# EasyEDA schematic SCH_mev battery_2023-11-28.json
TITLE: Mev latch circuit; REV: 2.0; Date: 2023-10-29; Sheet: 1/1; Drawn By: Stefano Scipioni; Company: Galileo
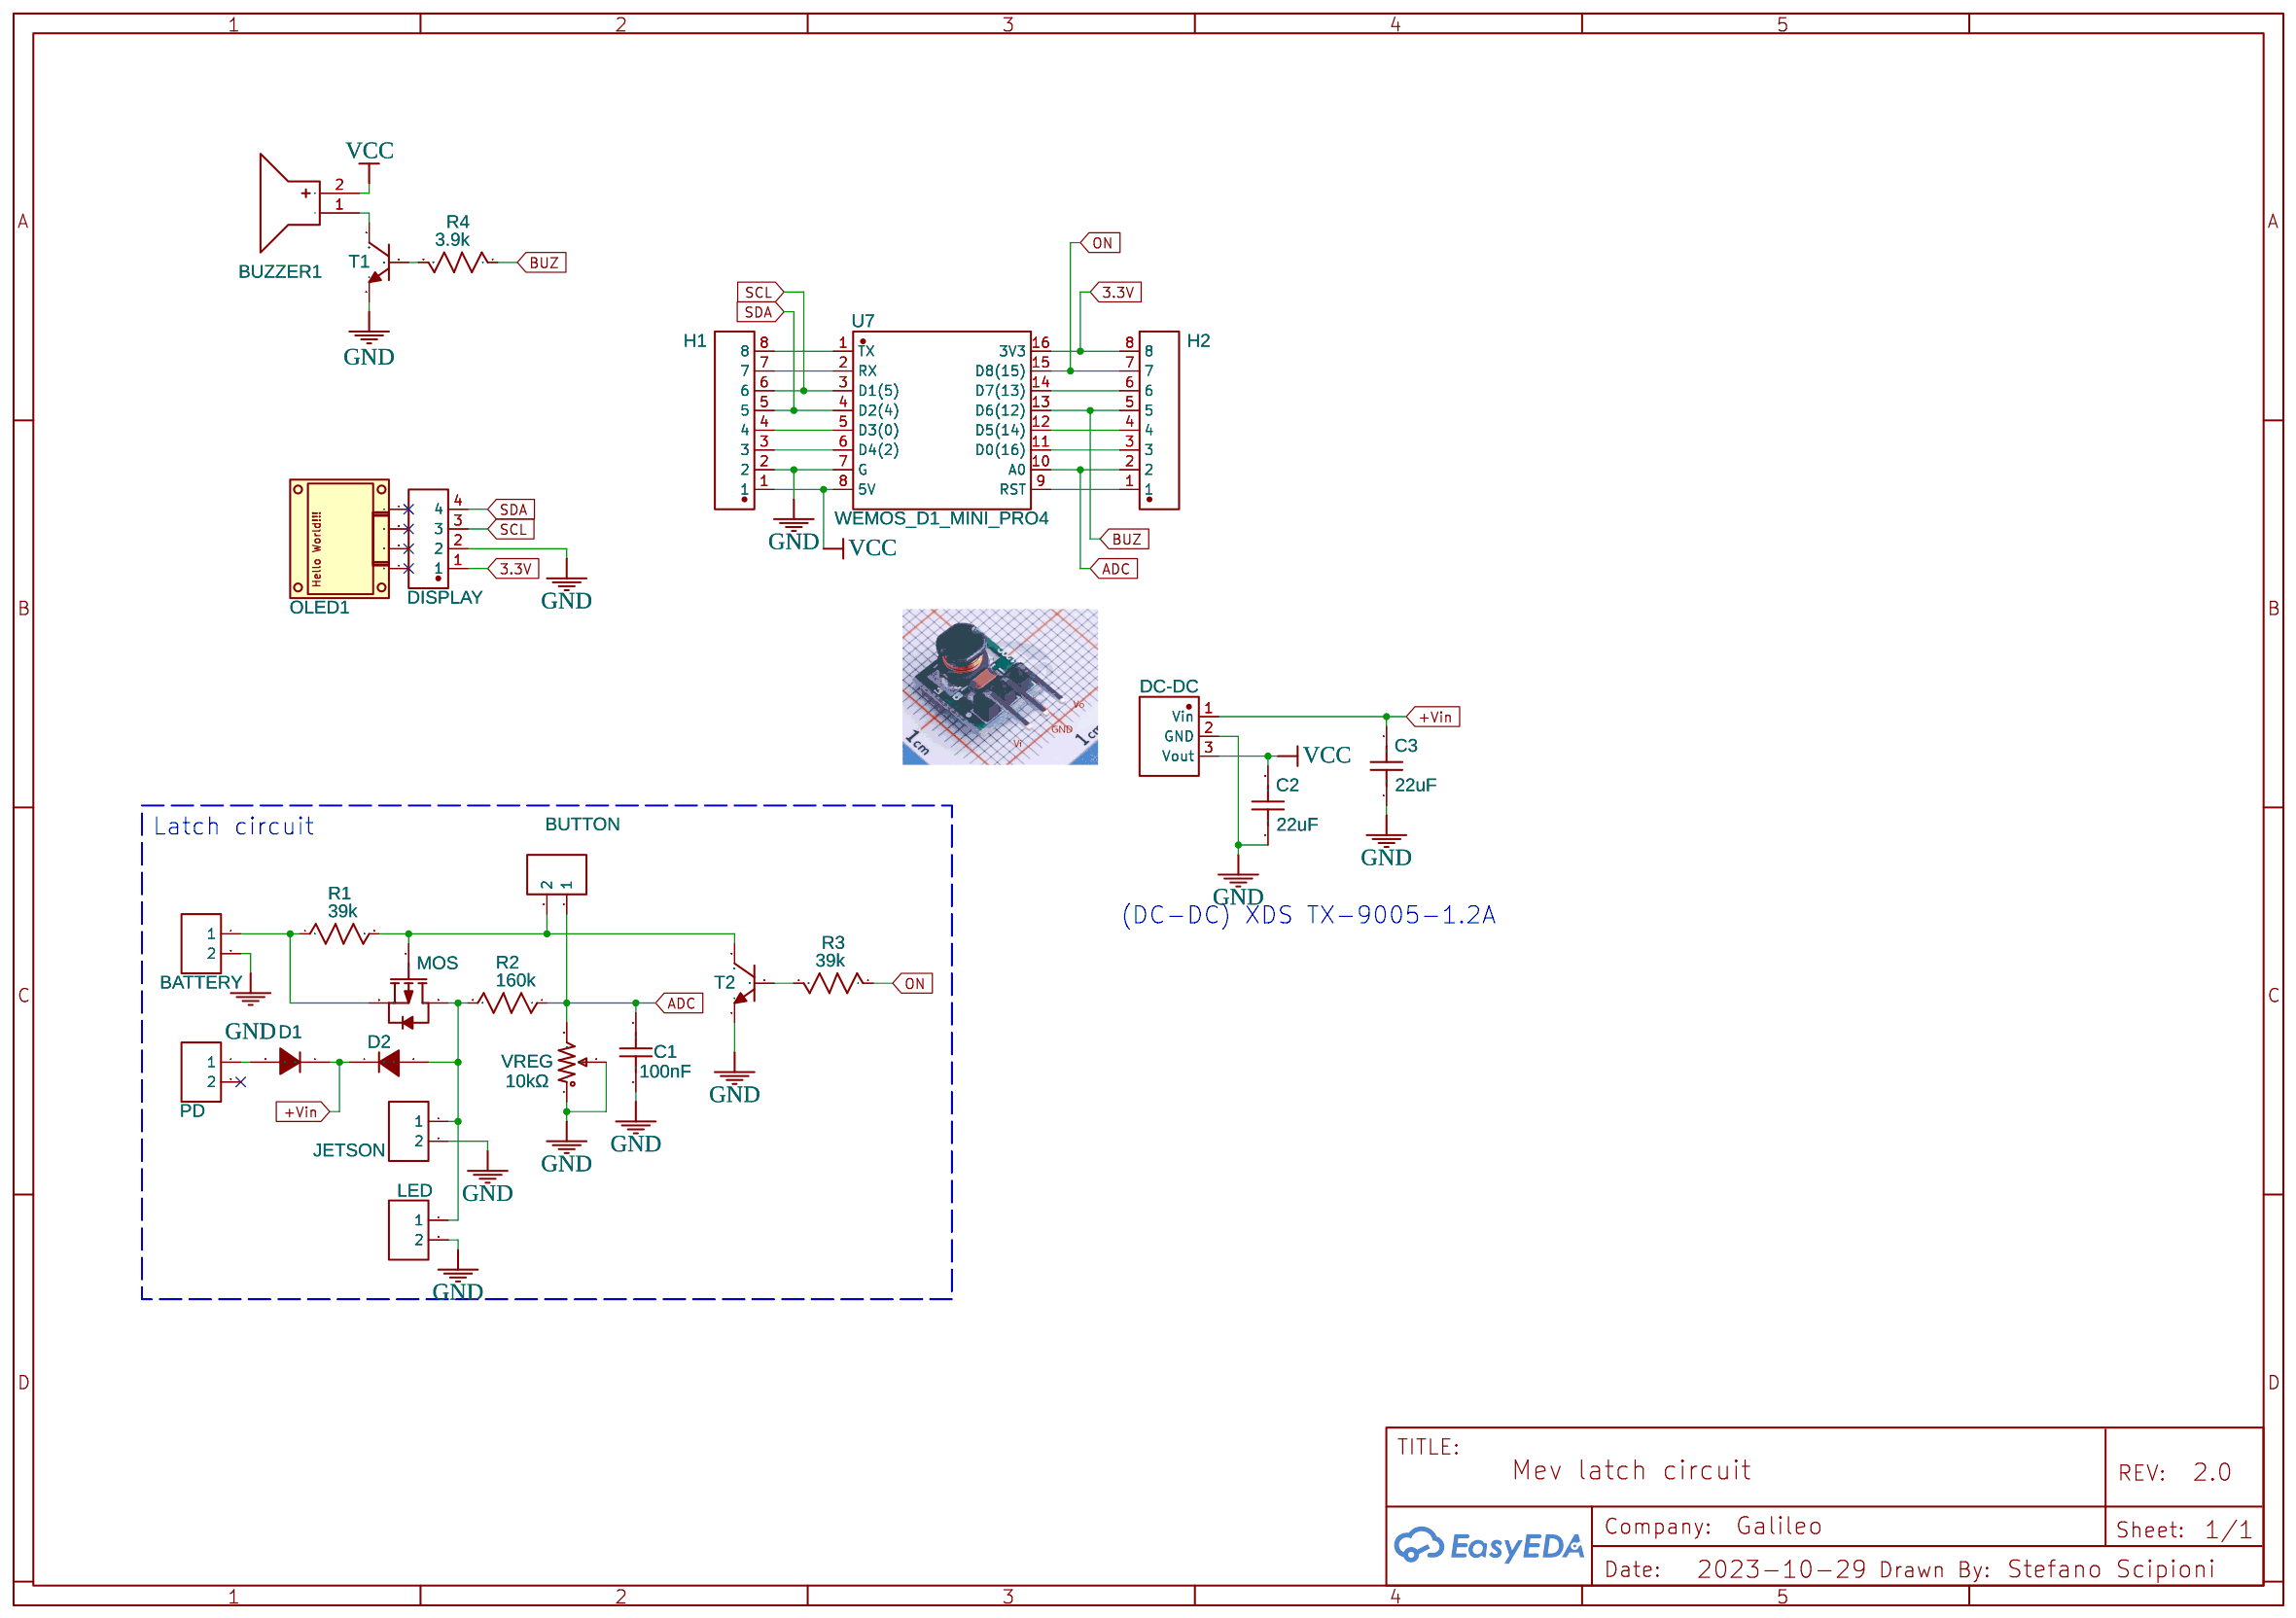
[diagram p0: schematic sheet]

## Parts
BATTERY  +Battery  [CONN-TH_XY118-5.0-2P]
BUTTON  Button  [HDR-F-2.54_1X2]
BUZZER1  BUZZER  [BUZ-TH_BD9.0-P5.00-D0.6-L-FD]
C1  100nF  [C0805]
C2  22uF  [C0805]
C3  22uF  [C0805]
D1  SD103AW_C5345965  [SOD-123_L2.8-W1.8-LS3.7-RD]
D2  SD103AW_C5345965  [SOD-123_L2.8-W1.8-LS3.7-RD]
DC-DC  DC-DC 5V  [SIP-3_L4.1-W1.6-P1.27-L]
DISPLAY  DISPLAY  [HDR-F-2.54_1X4]
H1  DS1023-1X8SF11  [HDR-TH_8P-P2.54-V-F]
H2  DS1023-1X8SF11  [HDR-TH_8P-P2.54-V-F]
JETSON  Jetson  [CONN-TH_XY118-5.0-2P]
LED  LED  [HDR-F-2.54_1X2]
MOS  AOD413A_C5261059  [TO-252-2_L6.6-W6.1-P4.58-LS10.1-BR-CW]
OLED1  0.96OLED_4P  [0.96OLED_4P]
PD  +PD  [CONN-TH_XY118-5.0-2P]
R1  39k  [R0805]
R2  160k  [R0805]
R3  39k  [R0805]
R4  3.9k  [R0805]
T1  MMBT3904_C7603197  [SOT-23-3_L2.9-W1.3-P0.95-LS2.4-BR]
T2  MMBT3904_C7603197  [SOT-23-3_L2.9-W1.3-P0.95-LS2.4-BR]
U7  WEMOS_D1_MINI_PRO4  [DIP-16_WEMOS_D1_MINI_PRO4]
VREG  10kΩ  [RES-ADJ-SMD_3P-L3.0-W3.8-P1.75-BR]

## Library data of the parts
BATTERY BUTTON JETSON LED PD = HDR-F-2.54_1x2: Supplier Part: C49661; Supplier: LCSC; Contributor: LCEDA_Lib
BUZZER1 = BUZZER: Contributor: lcsc; Supplier: LCSC; Supplier Part: C9900014030; Manufacturer: null; Manufacturer Part: buzzer; JLCPCB Part Class: Extended Part; link: https://lcsc.com/eda_search?q=C9900014030&%26type=1&ref=editor
C1 = C0805B104K500NT: Contributor: LCSC; Supplier: LCSC; Supplier Part: C476766; Manufacturer: TORCH(火炬); JLCPCB Part Class: Extended Part; link: https://lcsc.com/eda_search?q=C476766&%26type=1&ref=editor
C2 C3 = CL21A226MAYNNNE: Contributor: LCSC; Supplier: LCSC; Supplier Part: C602037; Manufacturer: SAMSUNG(三星); JLCPCB Part Class: Extended Part; link: https://lcsc.com/eda_search?q=C602037&%26type=1&ref=editor
D1 D2 = SD103AW_C5345965: Contributor: lcsc; Supplier: LCSC; Supplier Part: C5345965; Manufacturer: HXY MOSFET(华轩阳电子); Manufacturer Part: SD103AW; JLCPCB Part Class: Extended Part; link: https://lcsc.com/eda_search?q=C5345965&%26type=1&ref=editor
DC-DC = TLE4998S3XALA1: Contributor: LCSC; Supplier: LCSC; Supplier Part: C691127; Manufacturer: Infineon(英飞凌); JLCPCB Part Class: Extended Part; link: https://lcsc.com/eda_search?q=C1526568&%26type=1&ref=editor
DISPLAY = 1X4P: Contributor: lcsc; Supplier: LCSC; Supplier Part: C9900022166; Manufacturer: null; JLCPCB Part Class: Extended Part; link: https://lcsc.com/eda_search?q=C9900022166&%26type=1&ref=editor
H1 H2 = DS1023-1X8SF11: Supplier: LCSC; Supplier Part: C7509515; Manufacturer: CONNFLY; Manufacturer Part: DS1023-1x8SF11; Contributor: lcsc; JLCPCB Part Class: Extended Part; link: https://lcsc.com/eda_search?q=C7509515&%26type=1&ref=editor
MOS = AOD413A_C5261059: Contributor: lcsc; Supplier: LCSC; Supplier Part: C5261059; Manufacturer: HXY MOSFET(华轩阳电子); Manufacturer Part: AOD413A; JLCPCB Part Class: Extended Part; link: https://lcsc.com/eda_search?q=C5261059&%26type=1&ref=editor
OLED1 = 0.96OLED_4P: Supplier: LCSC; Contributor: LCEDA_Lib; Package Display: No
R1 R3 = R_0603_US: Supplier Part: C2933549; Supplier: LCSC; Contributor: LCEDA_Lib
R2 = R_0603_US: Supplier Part: C2933530; Supplier: LCSC; Contributor: LCEDA_Lib
R4 = R_0603_US: Supplier Part: C2930268; Supplier: LCSC; Contributor: LCEDA_Lib
T1 T2 = MMBT3904_C7603197: Supplier: LCSC; Supplier Part: C7603197; Manufacturer: KUU(永裕泰); Manufacturer Part: MMBT3904; Contributor: lcsc; link: https://lcsc.com/eda_search?q=C7603197&%26type=1&ref=editor
U7 = WEMOS_D1_MINI_PRO4: Contributor: LCSC; Supplier: LCSC; Supplier Part: C2837266; Manufacturer: null; Manufacturer Part: Wemos_D1_mini_Pro4; JLCPCB Part Class: Extended Part; link: https://lcsc.com/eda_search?q=C2837266&%26type=1&ref=editor
VREG = TC33X-2-103E: Contributor: LCSC; Supplier: LCSC; Supplier Part: C719176; Manufacturer: BOURNS; JLCPCB Part Class: Extended Part; link: https://lcsc.com/eda_search?q=C719176&%26type=1&ref=editor

## Nets
3.3V: DISPLAY.1 H2.8 U7.16(3V3)
+Vin: C3.2 D1.1(C) D2.1(C) DC-DC.1(Vin)
GND: BATTERY.2 C1.2 C2.1 C3.1 DC-DC.2(GND) DISPLAY.2 H1.2 JETSON.2 LED.2 T1.2(E) T2.2(E) U7.7(G) VREG.1 VREG.2
VCC: BUZZER1.2(+) C2.2 DC-DC.3(Vout) H1.1 U7.8(5V)
ADC: BUTTON.1 C1.1 H2.2 R2.1 U7.10(A0) VREG.3
BUZ: H2.5 R4.1 U7.13(D6(12))
ON: H2.7 R3.1 U7.15(D8(15))
SCL: DISPLAY.3 H1.6 U7.3(D1(5))
SDA: DISPLAY.4 H1.5 U7.4(D2(4))
Net-(BATTERY-1): BATTERY.1 MOS.3(S) R1.1
Net-(BUTTON-2): BUTTON.2 MOS.1(G) R1.2 T2.3(C)
Net-(BUZZER1-1): BUZZER1.1(-) T1.3(C)
Net-(D1-2): D1.2(A) PD.1
Net-(D2-2): D2.2(A) JETSON.1 LED.1 MOS.2(D) R2.2
Net-(H1-3): H1.3 U7.6(D4(2))
Net-(H1-4): H1.4 U7.5(D3(0))
Net-(H1-7): H1.7 U7.2(RX)
Net-(H1-8): H1.8 U7.1(TX)
Net-(H2-1): H2.1 U7.9(RST)
Net-(H2-3): H2.3 U7.11(D0(16))
Net-(H2-4): H2.4 U7.12(D5(14))
Net-(H2-6): H2.6 U7.14(D7(13))
Net-(R3-2): R3.2 T2.1(B)
Net-(R4-2): R4.2 T1.1(B)

Not connected (* = marked no-connect by the designer): OLED1 1* 2* 3* 4*; PD 2*

## Notes on the sheet
- Latch circuit
- (DC-DC) XDS TX-9005-1.2A
